# Altium schematic sheet microcontroller_input.SchDoc
size 420 x 297 mm; Author: Jan Rutkowski; CompanyName: AGH; SheetNumber: 4; SheetTotal: 4
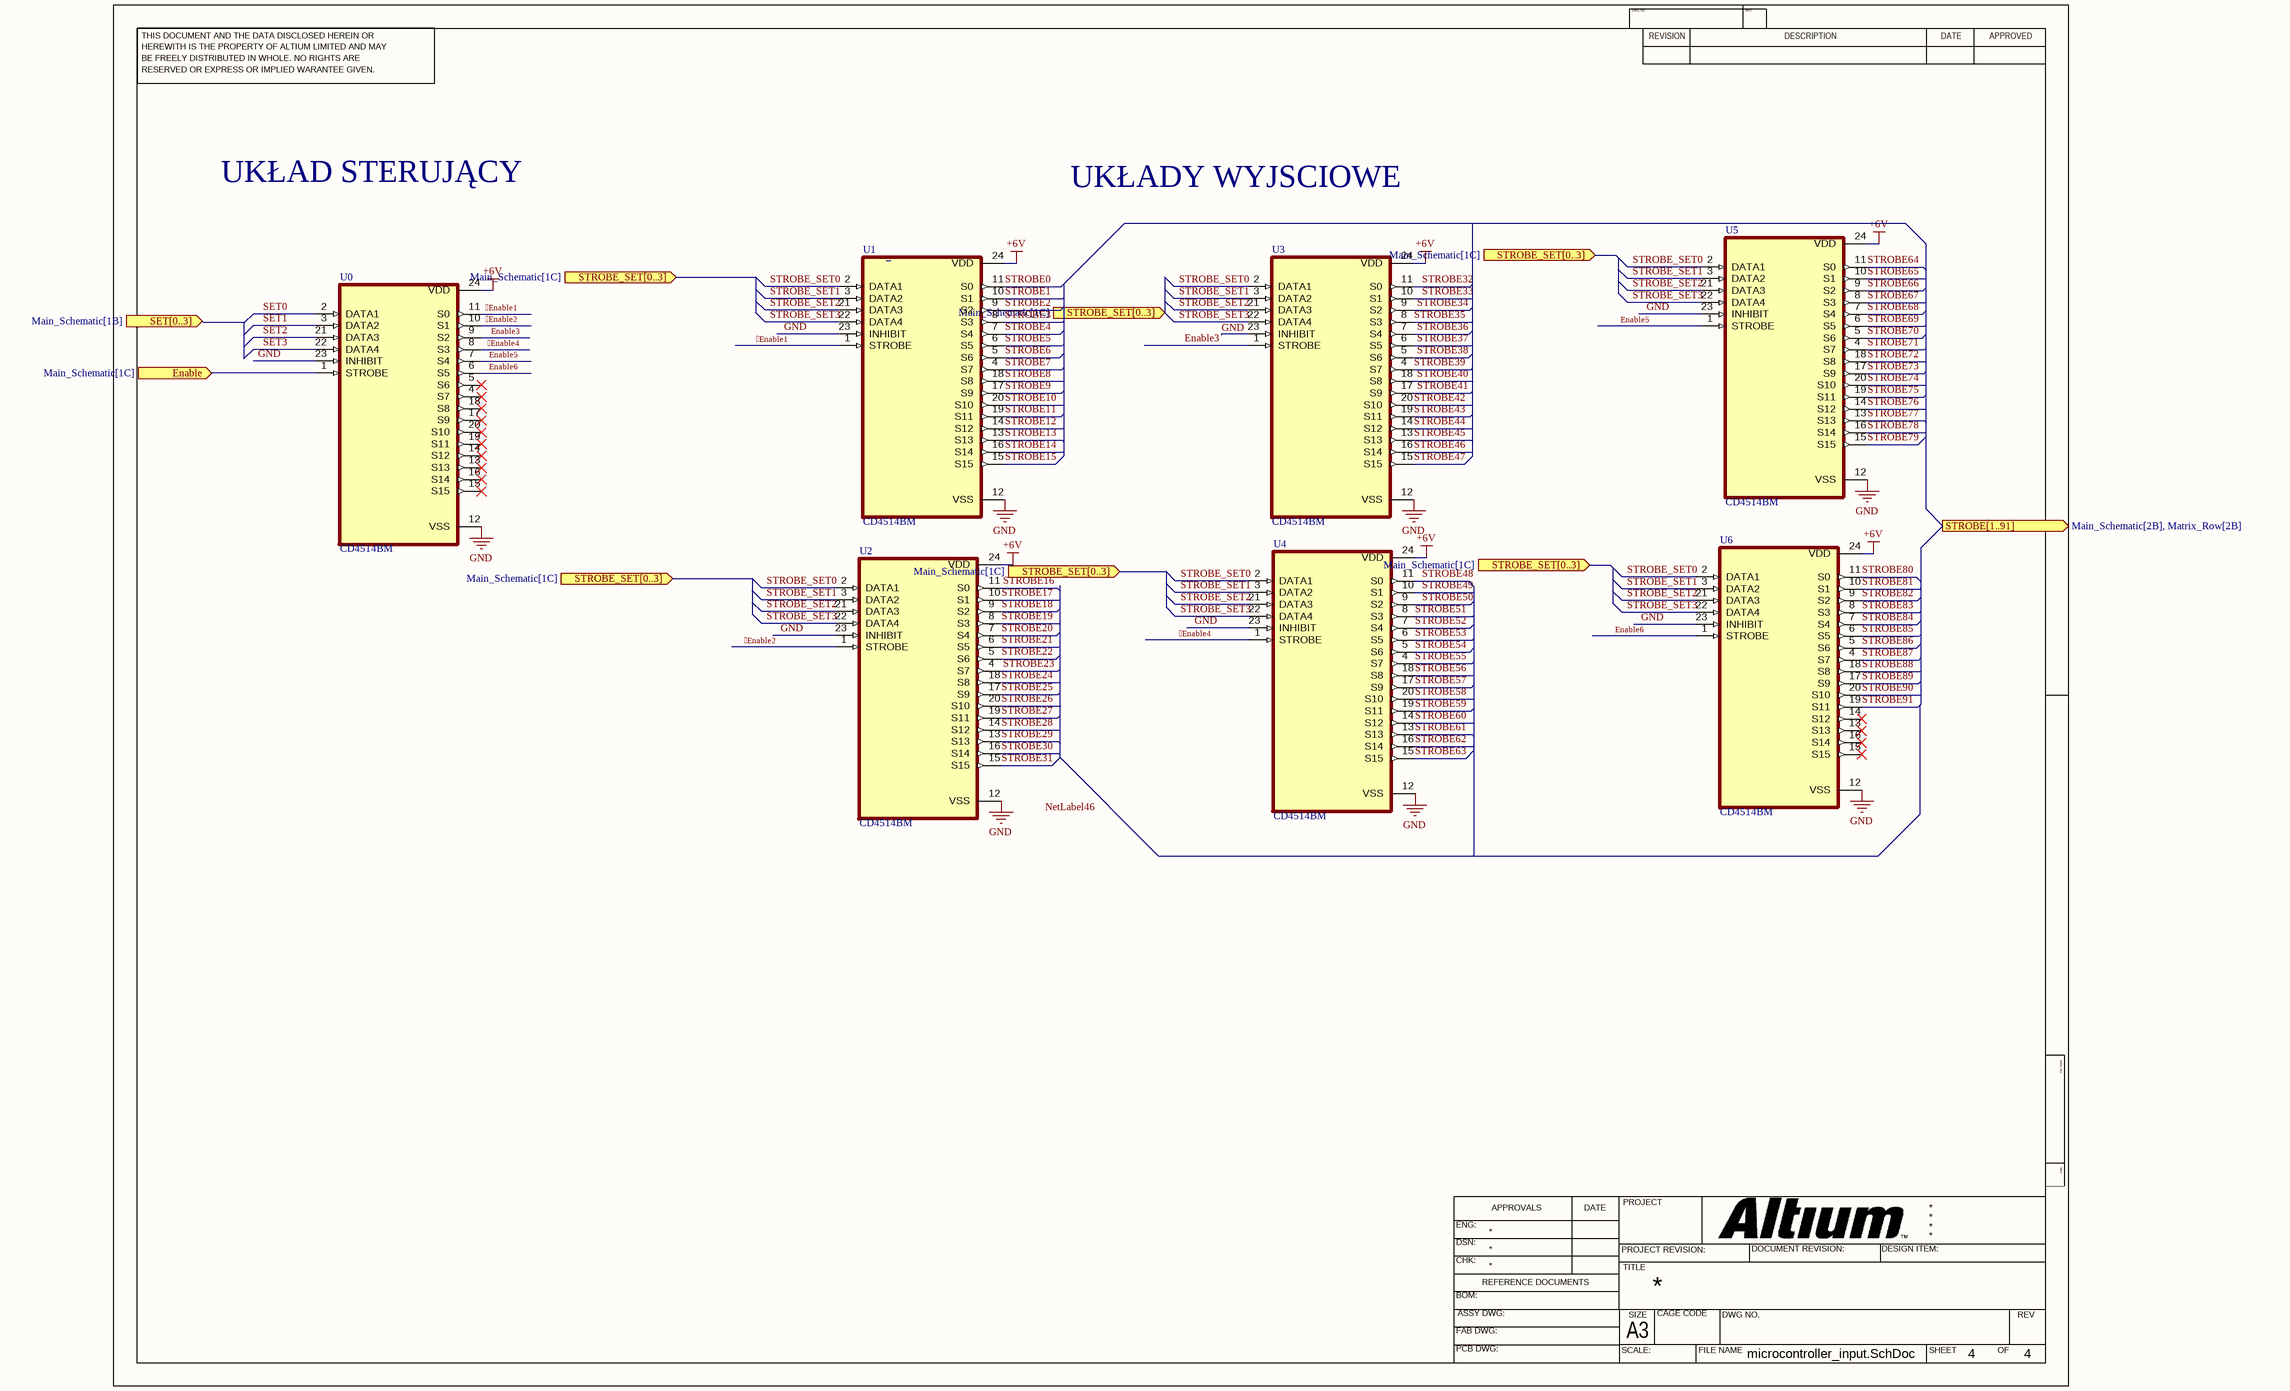
[diagram p0: microcontroller_input.SchDoc]

## Parts
U0  CD4514BM  [SOIC127P1030X265-24N]
U1  CD4514BM  [SOIC127P1030X265-24N]
U2  CD4514BM  [SOIC127P1030X265-24N]
U3  CD4514BM  [SOIC127P1030X265-24N]
U4  CD4514BM  [SOIC127P1030X265-24N]
U5  CD4514BM  [SOIC127P1030X265-24N]
U6  CD4514BM  [SOIC127P1030X265-24N]

## Ports
Enable (in, see Main_Schematic[1C]), SET[0..3] (in, see Main_Schematic[1B]), STROBE[1..91] (out, see Main_Schematic[2B], Matrix_Row[2B]), STROBE_SET[0..3] (in, see Main_Schematic[1C])

## Nets
+6V: U0.24(VDD) U1.24(VDD) U2.24(VDD) U3.24(VDD) U4.24(VDD) U5.24(VDD) U6.24(VDD)
GND: U0.12(VSS) U0.23(INHIBIT) U1.12(VSS) U1.23(INHIBIT) U2.12(VSS) U2.23(INHIBIT) U3.12(VSS) U3.23(INHIBIT) U4.12(VSS) U4.23(INHIBIT) U5.12(VSS) U5.23(INHIBIT) U6.12(VSS) U6.23(INHIBIT)
Enable1: U0.11(S0) U1.1(STROBE)
Enable2: U0.10(S1) U2.1(STROBE)
Enable4: U0.8(S3) U4.1(STROBE)
Enable: U0.1(STROBE) ; port Enable
Enable3: U0.9(S2) U3.1(STROBE)
Enable5: U0.7(S4) U5.1(STROBE)
Enable6: U0.6(S5) U6.1(STROBE)
SET0: U0.2(DATA1)
SET1: U0.3(DATA2)
SET2: U0.21(DATA3)
SET3: U0.22(DATA4)
STROBE0: U1.11(S0)
STROBE1: U1.10(S1)
STROBE2: U1.9(S2)
STROBE3: U1.8(S3)
STROBE4: U1.7(S4)
STROBE5: U1.6(S5)
STROBE6: U1.5(S6)
STROBE7: U1.4(S7)
STROBE8: U1.18(S8)
STROBE9: U1.17(S9)
STROBE10: U1.20(S10)
STROBE11: U1.19(S11)
STROBE12: U1.14(S12)
STROBE13: U1.13(S13)
STROBE14: U1.16(S14)
STROBE15: U1.15(S15)
STROBE16: U2.11(S0)
STROBE17: U2.10(S1)
STROBE18: U2.9(S2)
STROBE19: U2.8(S3)
STROBE20: U2.7(S4)
STROBE21: U2.6(S5)
STROBE22: U2.5(S6)
STROBE23: U2.4(S7)
STROBE24: U2.18(S8)
STROBE25: U2.17(S9)
STROBE26: U2.20(S10)
STROBE27: U2.19(S11)
STROBE28: U2.14(S12)
STROBE29: U2.13(S13)
STROBE30: U2.16(S14)
STROBE31: U2.15(S15)
STROBE32: U3.11(S0)
STROBE33: U3.10(S1)
STROBE34: U3.9(S2)
STROBE35: U3.8(S3)
STROBE36: U3.7(S4)
STROBE37: U3.6(S5)
STROBE38: U3.5(S6)
STROBE39: U3.4(S7)
STROBE40: U3.18(S8)
STROBE41: U3.17(S9)
STROBE42: U3.20(S10)
STROBE43: U3.19(S11)
STROBE44: U3.14(S12)
STROBE45: U3.13(S13)
STROBE46: U3.16(S14)
STROBE47: U3.15(S15)
STROBE48: U4.11(S0)
STROBE49: U4.10(S1)
STROBE50: U4.9(S2)
STROBE51: U4.8(S3)
STROBE52: U4.7(S4)
STROBE53: U4.6(S5)
STROBE54: U4.5(S6)
STROBE55: U4.4(S7)
STROBE56: U4.18(S8)
STROBE57: U4.17(S9)
STROBE58: U4.20(S10)
STROBE59: U4.19(S11)
STROBE60: U4.14(S12)
STROBE61: U4.13(S13)
STROBE62: U4.16(S14)
STROBE63: U4.15(S15)
STROBE64: U5.11(S0)
STROBE65: U5.10(S1)
STROBE66: U5.9(S2)
STROBE67: U5.8(S3)
STROBE68: U5.7(S4)
STROBE69: U5.6(S5)
STROBE70: U5.5(S6)
STROBE71: U5.4(S7)
STROBE72: U5.18(S8)
STROBE73: U5.17(S9)
STROBE74: U5.20(S10)
STROBE75: U5.19(S11)
STROBE76: U5.14(S12)
STROBE77: U5.13(S13)
STROBE78: U5.16(S14)
STROBE79: U5.15(S15)
STROBE80: U6.11(S0)
STROBE81: U6.10(S1)
STROBE82: U6.9(S2)
STROBE83: U6.8(S3)
STROBE84: U6.7(S4)
STROBE85: U6.6(S5)
STROBE86: U6.5(S6)
STROBE87: U6.4(S7)
STROBE88: U6.18(S8)
STROBE89: U6.17(S9)
STROBE90: U6.20(S10)
STROBE91: U6.19(S11)
STROBE_SET0: U1.2(DATA1) U2.2(DATA1) U3.2(DATA1) U4.2(DATA1) U5.2(DATA1) U6.2(DATA1)
STROBE_SET1: U1.3(DATA2) U2.3(DATA2) U3.3(DATA2) U4.3(DATA2) U5.3(DATA2) U6.3(DATA2)
STROBE_SET2: U1.21(DATA3) U2.21(DATA3) U3.21(DATA3) U4.21(DATA3) U5.21(DATA3) U6.21(DATA3)
STROBE_SET3: U1.22(DATA4) U2.22(DATA4) U3.22(DATA4) U4.22(DATA4) U5.22(DATA4) U6.22(DATA4)

Not connected (* = marked no-connect by the designer): U0 4(S7)* 5(S6)* 13(S13)* 14(S12)* 15(S15)* 16(S14)* 17(S9)* 18(S8)* 19(S11)* 20(S10)*; U6 13(S13)* 14(S12)* 15(S15)* 16(S14)*

## Notes on the sheet
- UKŁAD STERUJĄCY
- UKŁADY WYJSCIOWE
- Labels drawn without touching a wire or pin: NetLabel46
- THIS DOCUMENT AND THE DATA DISCLOSED HEREIN OR
- HEREWITH IS THE PROPERTY OF ALTIUM LIMITED AND MAY
- DWG NO:
- REVISION
- REV:
- DESCRIPTION
- DATE
- APPROVED
- BE FREELY DISTRIBUTED IN WHOLE. NO RIGHTS ARE
- RESERVED OR EXPRESS OR IMPLIED WARANTEE GIVEN.
- ENG:
- APPROVALS
- PROJECT
- DSN:
- CHK:
- REFERENCE DOCUMENTS
- PROJECT REVISION:
- TITLE
- DOCUMENT REVISION:
- DESIGN ITEM:
- BOM:
- FAB DWG:
- PCB DWG:
- ASSY DWG:
- SCALE:
- A3
- SIZE
- CAGE CODE
- FILE NAME
- DWG NO.
- SHEET
- OF
- REV

## Library data of the parts
U0-U6 = CD4514BM: CMOS 4-Bit Latch/4-to-16 Line Decoder with Output 'High' on Select; MF: Texas Instruments; SnapEDA_Link: https://www.snapeda.com/parts/CD4514BM/Texas+Instruments/view-part/?ref=snap; Package: SOIC-24 Texas Instruments; Value: *; MP: CD4514BM; Check_prices: https://www.snapeda.com/parts/CD4514BM/Texas+Instruments/view-part/?ref=eda